# Altium schematic sheet LEDMatrix_Schematic.SchDoc
size A4
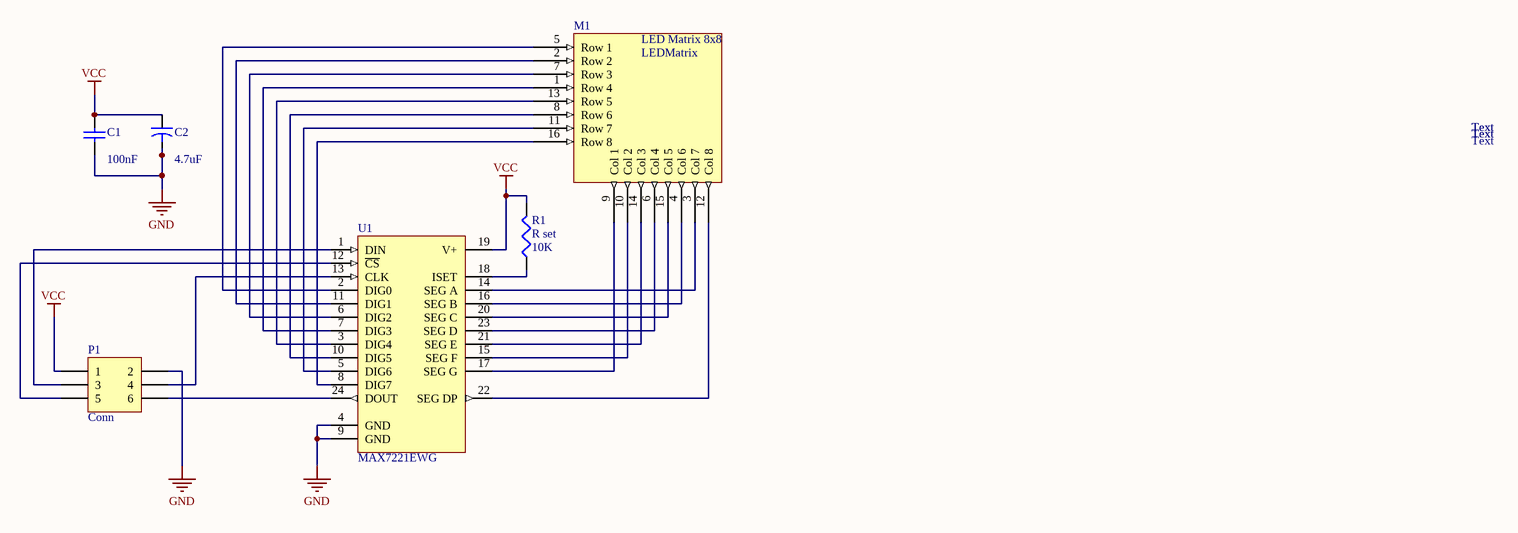
[diagram p0: LEDMatrix_Schematic.SchDoc]

## Parts
C1  value 100nF  [C1206]
C2  value 4.7uF  [CAPR5-4X5]
M1  LEDMatrix  [LEDMATRIX]
P1  Conn  [HDR2X3H]
R1  R set  value 10K  [RESC2012N]
U1  MAX7221EWG  [WSO24_N]

## Nets
GND: C1.1 C2.2 P1.2 U1.4(GND) U1.9(GND)
VCC: C1.2 C2.1 P1.1 R1.2 U1.19(V+)
NetM1_1: M1.1(Row_4) U1.7(DIG3)
NetM1_2: M1.2(Row_2) U1.11(DIG1)
NetM1_3: M1.3(Col_7) U1.14(SEG_A)
NetM1_4: M1.4(Col_6) U1.16(SEG_B)
NetM1_5: M1.5(Row_1) U1.2(DIG0)
NetM1_6: M1.6(Col_4) U1.23(SEG_D)
NetM1_7: M1.7(Row_3) U1.6(DIG2)
NetM1_8: M1.8(Row_6) U1.10(DIG5)
NetM1_9: M1.9(Col_1) U1.17(SEG_G)
NetM1_10: M1.10(Col_2) U1.15(SEG_F)
NetM1_11: M1.11(Row_7) U1.5(DIG6)
NetM1_12: M1.12(Col_8) U1.22(SEG_DP)
NetM1_13: M1.13(Row_5) U1.3(DIG4)
NetM1_14: M1.14(Col_3) U1.21(SEG_E)
NetM1_15: M1.15(Col_5) U1.20(SEG_C)
NetM1_16: M1.16(Row_8) U1.8(DIG7)
NetP1_3: P1.3 U1.1(DIN)
NetP1_4: P1.4 U1.13(CLK)
NetP1_5: P1.5 U1.12(~{CS})
NetP1_6: P1.6 U1.24(DOUT)
NetR1_1: R1.1 U1.18(ISET)

## Notes on the sheet
- Text
- (in symbol LEDMatrix) LED Matrix 8x8

## Library data of the parts
C1 = Cap Semi: Capacitor (Semiconductor SIM Model); Published: 8-Jun-2000; LatestRevisionDate: 29-May-2009; LatestRevisionNote: IPC-7351 Footprint Added.; PackageReference: C1206; Publisher: Altium Limited; PackageDescription: Chip Capacitor
C2 = Cap2: Capacitor; Published: 23-Sep-2002; PackageReference: CAPR5-4X5; Publisher: Altium Limited; PackageDescription: Capacitor; 2 Leads
M1 = LEDMatrix: LED Matrix 8x8 white
P1 = Header 3X2H: Header, 3-Pin, Dual row, Right Angle; LatestRevisionDate: 17-Jul-2002; LatestRevisionNote: Re-released for DXP Platform.; Publisher: Altium Limited
R1 = Res3: Resistor; Published: 8-Jun-2000; LatestRevisionDate: 29-May-2009; LatestRevisionNote: IPC-7351 Footprint Added.; PackageReference: J1-0603; Publisher: Altium Limited; PackageDescription: Chip Resistor
U1 = MAX7221EWG: Serially Interfaced, 8-Digit LED Display Driver; Note: The 8 digit drivers and the 7 segment drivers are high-impedance when turned off.; Published: 16-Jan-2001; LatestRevisionDate: 13-Apr-2006; LatestRevisionNote: IPC-7351 Footprint Added.; DatasheetVersion: Jul-1997; PackageReference: WSO24; Publisher: Altium Limited; PackageDescription: 24-Pin Small Outline Integrated Circuit 1.27 mm Pitch; ComponentLink1Description: Manufacturer Link; ComponentLink1URL: http://www.maxim-ic.com/; ComponentLink2Description: Datasheet; ComponentLink2URL: http://pdfserv.maxim-ic.com/en/ds/MAX7219-MAX7221.pdf